# Altium schematic sheet 0050_X16 PEG P0-P7 COUP.SchDoc
size A3
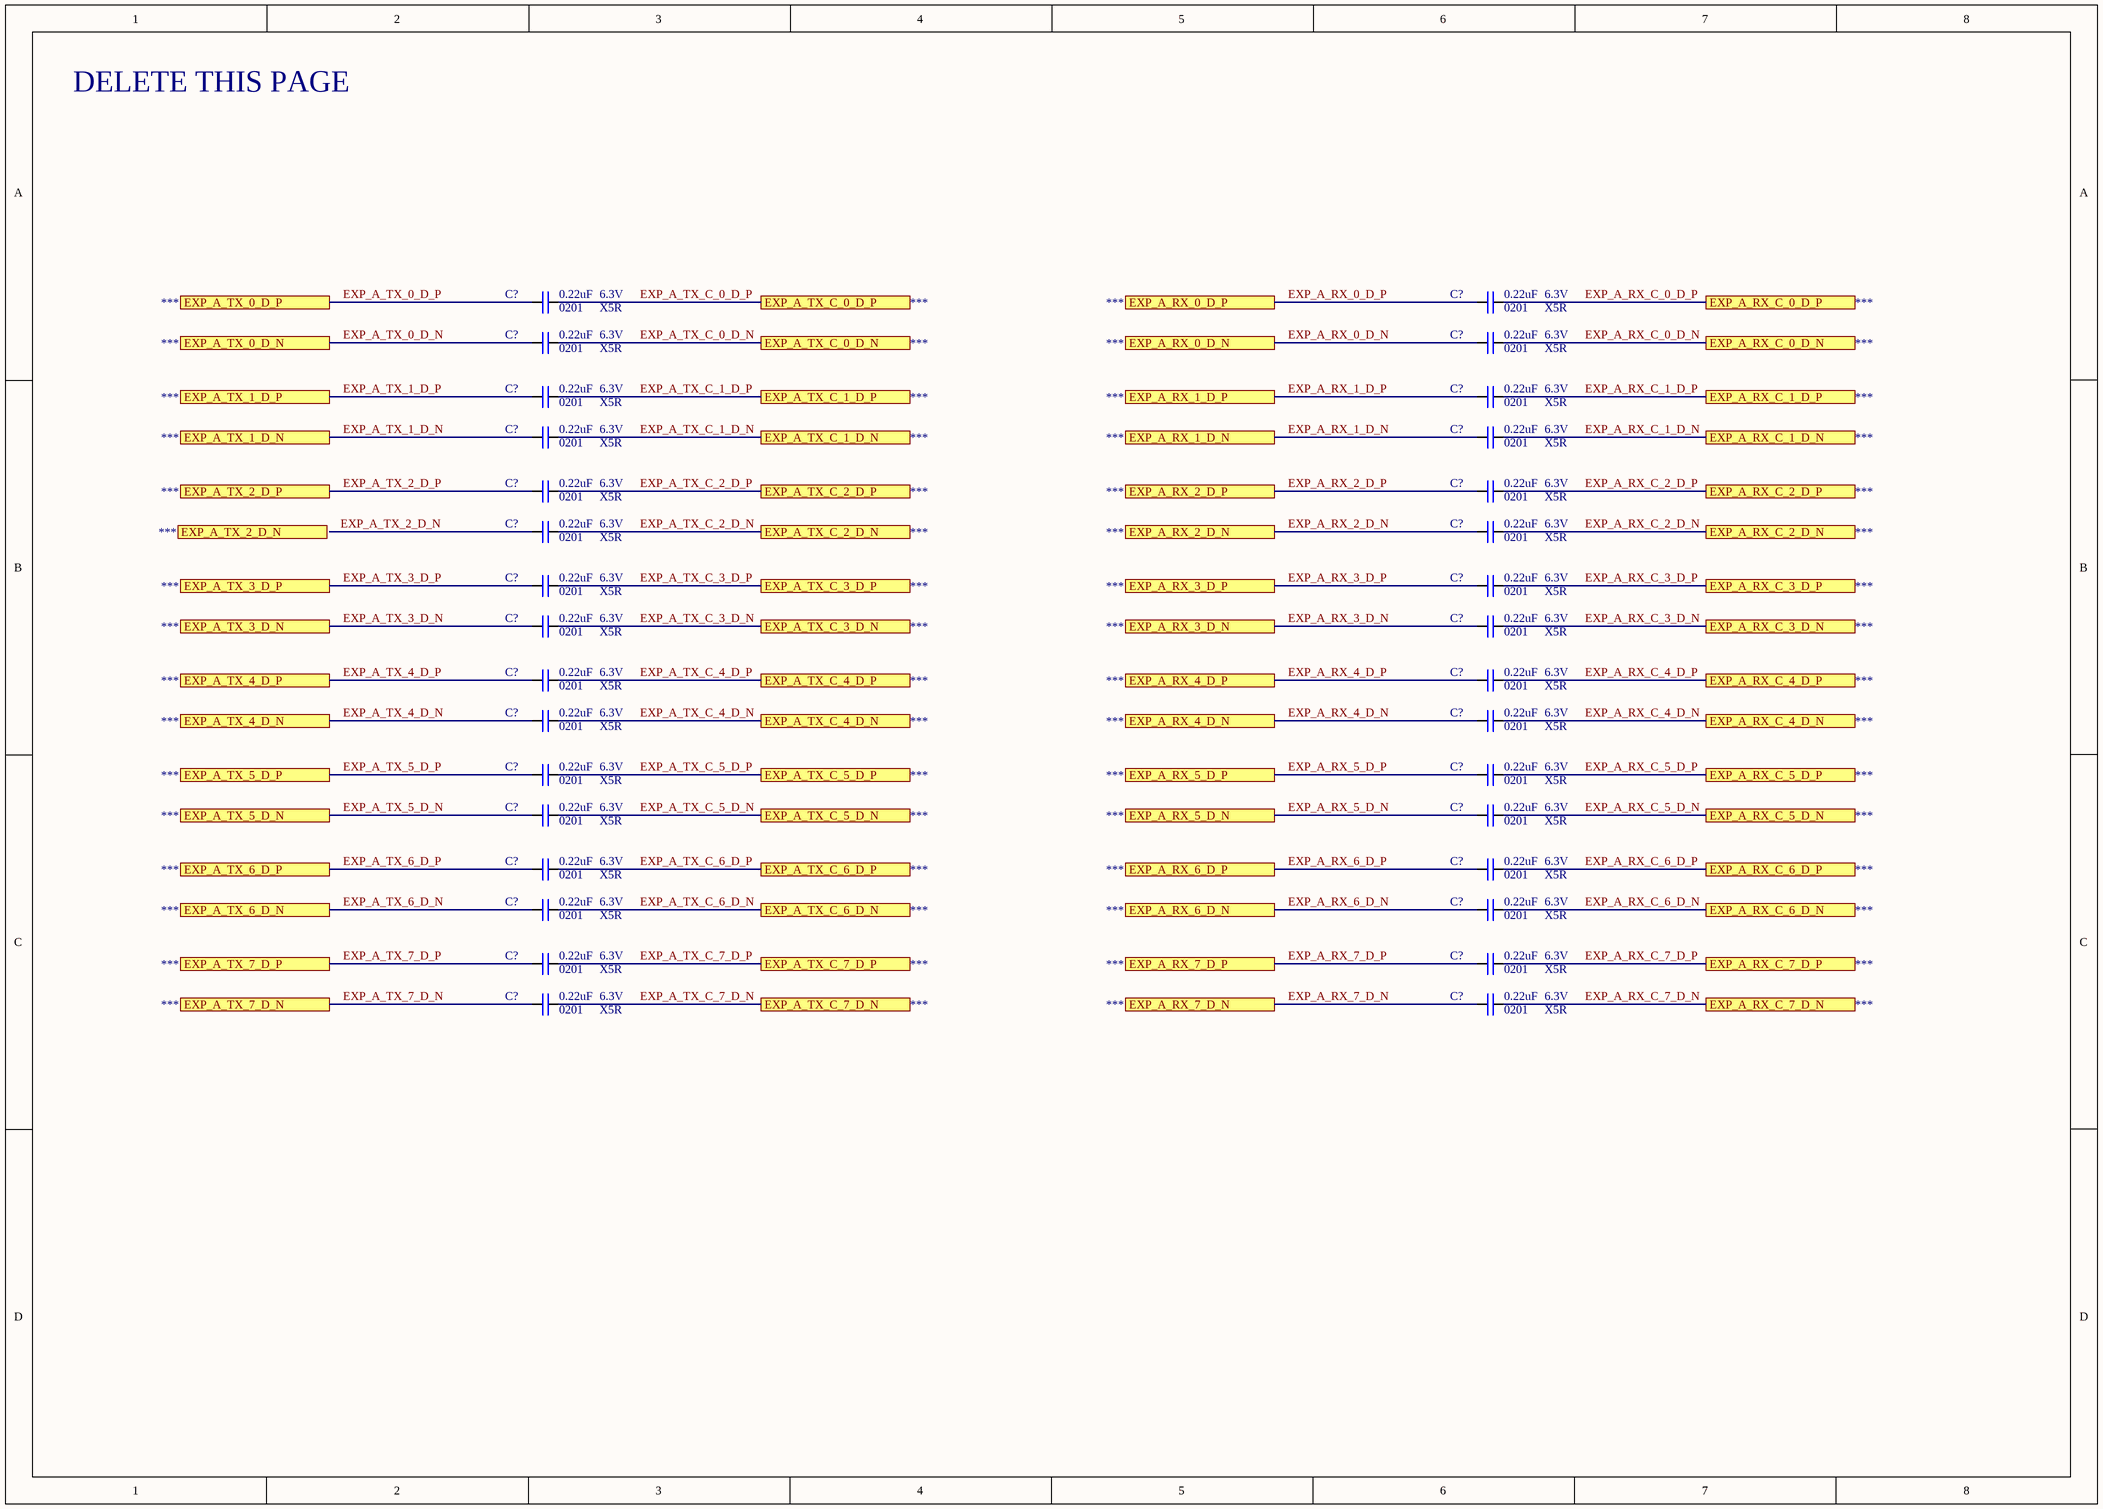
[diagram p0: 0050_X16 PEG P0-P7 COUP.SchDoc]

## Parts
(Parts that share a designator on the sheet are numbered #1, #2 ... from top to bottom, then left to right.)
C?#1  value 0.22uF  Case/Package: 0201  Voltage: 6.3V  Dielectric: X5R  [CAPC0201]
C?#2  value 0.22uF  Case/Package: 0201  Voltage: 6.3V  Dielectric: X5R  [CAPC0201]
C?#3  value 0.22uF  Case/Package: 0201  Voltage: 6.3V  Dielectric: X5R  [CAPC0201]
C?#4  value 0.22uF  Case/Package: 0201  Voltage: 6.3V  Dielectric: X5R  [CAPC0201]
C?#5  value 0.22uF  Case/Package: 0201  Voltage: 6.3V  Dielectric: X5R  [CAPC0201]
C?#6  value 0.22uF  Case/Package: 0201  Voltage: 6.3V  Dielectric: X5R  [CAPC0201]
C?#7  value 0.22uF  Case/Package: 0201  Voltage: 6.3V  Dielectric: X5R  [CAPC0201]
C?#8  value 0.22uF  Case/Package: 0201  Voltage: 6.3V  Dielectric: X5R  [CAPC0201]
C?#9  value 0.22uF  Case/Package: 0201  Voltage: 6.3V  Dielectric: X5R  [CAPC0201]
C?#10  value 0.22uF  Case/Package: 0201  Voltage: 6.3V  Dielectric: X5R  [CAPC0201]
C?#11  value 0.22uF  Case/Package: 0201  Voltage: 6.3V  Dielectric: X5R  [CAPC0201]
C?#12  value 0.22uF  Case/Package: 0201  Voltage: 6.3V  Dielectric: X5R  [CAPC0201]
C?#13  value 0.22uF  Case/Package: 0201  Voltage: 6.3V  Dielectric: X5R  [CAPC0201]
C?#14  value 0.22uF  Case/Package: 0201  Voltage: 6.3V  Dielectric: X5R  [CAPC0201]
C?#15  value 0.22uF  Case/Package: 0201  Voltage: 6.3V  Dielectric: X5R  [CAPC0201]
C?#16  value 0.22uF  Case/Package: 0201  Voltage: 6.3V  Dielectric: X5R  [CAPC0201]
C?#17  value 0.22uF  Case/Package: 0201  Voltage: 6.3V  Dielectric: X5R  [CAPC0201]
C?#18  value 0.22uF  Case/Package: 0201  Voltage: 6.3V  Dielectric: X5R  [CAPC0201]
C?#19  value 0.22uF  Case/Package: 0201  Voltage: 6.3V  Dielectric: X5R  [CAPC0201]
C?#20  value 0.22uF  Case/Package: 0201  Voltage: 6.3V  Dielectric: X5R  [CAPC0201]
C?#21  value 0.22uF  Case/Package: 0201  Voltage: 6.3V  Dielectric: X5R  [CAPC0201]
C?#22  value 0.22uF  Case/Package: 0201  Voltage: 6.3V  Dielectric: X5R  [CAPC0201]
C?#23  value 0.22uF  Case/Package: 0201  Voltage: 6.3V  Dielectric: X5R  [CAPC0201]
C?#24  value 0.22uF  Case/Package: 0201  Voltage: 6.3V  Dielectric: X5R  [CAPC0201]
C?#25  value 0.22uF  Case/Package: 0201  Voltage: 6.3V  Dielectric: X5R  [CAPC0201]
C?#26  value 0.22uF  Case/Package: 0201  Voltage: 6.3V  Dielectric: X5R  [CAPC0201]
C?#27  value 0.22uF  Case/Package: 0201  Voltage: 6.3V  Dielectric: X5R  [CAPC0201]
C?#28  value 0.22uF  Case/Package: 0201  Voltage: 6.3V  Dielectric: X5R  [CAPC0201]
C?#29  value 0.22uF  Case/Package: 0201  Voltage: 6.3V  Dielectric: X5R  [CAPC0201]
C?#30  value 0.22uF  Case/Package: 0201  Voltage: 6.3V  Dielectric: X5R  [CAPC0201]
C?#31  value 0.22uF  Case/Package: 0201  Voltage: 6.3V  Dielectric: X5R  [CAPC0201]
C?#32  value 0.22uF  Case/Package: 0201  Voltage: 6.3V  Dielectric: X5R  [CAPC0201]

## Ports
EXP_A_RX_0_D_N, EXP_A_RX_0_D_P, EXP_A_RX_1_D_N, EXP_A_RX_1_D_P, EXP_A_RX_2_D_N, EXP_A_RX_2_D_P, EXP_A_RX_3_D_N, EXP_A_RX_3_D_P, EXP_A_RX_4_D_N, EXP_A_RX_4_D_P, EXP_A_RX_5_D_N, EXP_A_RX_5_D_P, EXP_A_RX_6_D_N, EXP_A_RX_6_D_P, EXP_A_RX_7_D_N, EXP_A_RX_7_D_P, EXP_A_RX_C_0_D_N, EXP_A_RX_C_0_D_P, EXP_A_RX_C_1_D_N, EXP_A_RX_C_1_D_P, EXP_A_RX_C_2_D_N, EXP_A_RX_C_2_D_P, EXP_A_RX_C_3_D_N, EXP_A_RX_C_3_D_P, EXP_A_RX_C_4_D_N, EXP_A_RX_C_4_D_P, EXP_A_RX_C_5_D_N, EXP_A_RX_C_5_D_P, EXP_A_RX_C_6_D_N, EXP_A_RX_C_6_D_P, EXP_A_RX_C_7_D_N, EXP_A_RX_C_7_D_P, EXP_A_TX_0_D_N, EXP_A_TX_0_D_P, EXP_A_TX_1_D_N, EXP_A_TX_1_D_P, EXP_A_TX_2_D_N, EXP_A_TX_2_D_P, EXP_A_TX_3_D_N, EXP_A_TX_3_D_P, EXP_A_TX_4_D_N, EXP_A_TX_4_D_P, EXP_A_TX_5_D_N, EXP_A_TX_5_D_P, EXP_A_TX_6_D_N, EXP_A_TX_6_D_P, EXP_A_TX_7_D_N, EXP_A_TX_7_D_P, EXP_A_TX_C_0_D_N, EXP_A_TX_C_0_D_P, EXP_A_TX_C_1_D_N, EXP_A_TX_C_1_D_P, EXP_A_TX_C_2_D_N, EXP_A_TX_C_2_D_P, EXP_A_TX_C_3_D_N, EXP_A_TX_C_3_D_P, EXP_A_TX_C_4_D_N, EXP_A_TX_C_4_D_P, EXP_A_TX_C_5_D_N, EXP_A_TX_C_5_D_P, EXP_A_TX_C_6_D_N, EXP_A_TX_C_6_D_P, EXP_A_TX_C_7_D_N, EXP_A_TX_C_7_D_P

## Nets
EXP_A_RX_0_D_N: C?#4.1 ; port EXP_A_RX_0_D_N
EXP_A_RX_0_D_P: C?#2.1 ; port EXP_A_RX_0_D_P
EXP_A_RX_1_D_N: C?#8.1 ; port EXP_A_RX_1_D_N
EXP_A_RX_1_D_P: C?#6.1 ; port EXP_A_RX_1_D_P
EXP_A_RX_2_D_N: C?#12.1 ; port EXP_A_RX_2_D_N
EXP_A_RX_2_D_P: C?#10.1 ; port EXP_A_RX_2_D_P
EXP_A_RX_3_D_N: C?#16.1 ; port EXP_A_RX_3_D_N
EXP_A_RX_3_D_P: C?#14.1 ; port EXP_A_RX_3_D_P
EXP_A_RX_4_D_N: C?#20.1 ; port EXP_A_RX_4_D_N
EXP_A_RX_4_D_P: C?#18.1 ; port EXP_A_RX_4_D_P
EXP_A_RX_5_D_N: C?#24.1 ; port EXP_A_RX_5_D_N
EXP_A_RX_5_D_P: C?#22.1 ; port EXP_A_RX_5_D_P
EXP_A_RX_6_D_N: C?#28.1 ; port EXP_A_RX_6_D_N
EXP_A_RX_6_D_P: C?#26.1 ; port EXP_A_RX_6_D_P
EXP_A_RX_7_D_N: C?#32.1 ; port EXP_A_RX_7_D_N
EXP_A_RX_7_D_P: C?#30.1 ; port EXP_A_RX_7_D_P
EXP_A_RX_C_0_D_N: C?#4.2 ; port EXP_A_RX_C_0_D_N
EXP_A_RX_C_0_D_P: C?#2.2 ; port EXP_A_RX_C_0_D_P
EXP_A_RX_C_1_D_N: C?#8.2 ; port EXP_A_RX_C_1_D_N
EXP_A_RX_C_1_D_P: C?#6.2 ; port EXP_A_RX_C_1_D_P
EXP_A_RX_C_2_D_N: C?#12.2 ; port EXP_A_RX_C_2_D_N
EXP_A_RX_C_2_D_P: C?#10.2 ; port EXP_A_RX_C_2_D_P
EXP_A_RX_C_3_D_N: C?#16.2 ; port EXP_A_RX_C_3_D_N
EXP_A_RX_C_3_D_P: C?#14.2 ; port EXP_A_RX_C_3_D_P
EXP_A_RX_C_4_D_N: C?#20.2 ; port EXP_A_RX_C_4_D_N
EXP_A_RX_C_4_D_P: C?#18.2 ; port EXP_A_RX_C_4_D_P
EXP_A_RX_C_5_D_N: C?#24.2 ; port EXP_A_RX_C_5_D_N
EXP_A_RX_C_5_D_P: C?#22.2 ; port EXP_A_RX_C_5_D_P
EXP_A_RX_C_6_D_N: C?#28.2 ; port EXP_A_RX_C_6_D_N
EXP_A_RX_C_6_D_P: C?#26.2 ; port EXP_A_RX_C_6_D_P
EXP_A_RX_C_7_D_N: C?#32.2 ; port EXP_A_RX_C_7_D_N
EXP_A_RX_C_7_D_P: C?#30.2 ; port EXP_A_RX_C_7_D_P
EXP_A_TX_0_D_N: C?#3.1 ; port EXP_A_TX_0_D_N
EXP_A_TX_0_D_P: C?#1.1 ; port EXP_A_TX_0_D_P
EXP_A_TX_1_D_N: C?#7.1 ; port EXP_A_TX_1_D_N
EXP_A_TX_1_D_P: C?#5.1 ; port EXP_A_TX_1_D_P
EXP_A_TX_2_D_N: C?#11.1
EXP_A_TX_2_D_P: C?#9.1 ; port EXP_A_TX_2_D_P
EXP_A_TX_3_D_N: C?#15.1 ; port EXP_A_TX_3_D_N
EXP_A_TX_3_D_P: C?#13.1 ; port EXP_A_TX_3_D_P
EXP_A_TX_4_D_N: C?#19.1 ; port EXP_A_TX_4_D_N
EXP_A_TX_4_D_P: C?#17.1 ; port EXP_A_TX_4_D_P
EXP_A_TX_5_D_N: C?#23.1 ; port EXP_A_TX_5_D_N
EXP_A_TX_5_D_P: C?#21.1 ; port EXP_A_TX_5_D_P
EXP_A_TX_6_D_N: C?#27.1 ; port EXP_A_TX_6_D_N
EXP_A_TX_6_D_P: C?#25.1 ; port EXP_A_TX_6_D_P
EXP_A_TX_7_D_N: C?#31.1 ; port EXP_A_TX_7_D_N
EXP_A_TX_7_D_P: C?#29.1 ; port EXP_A_TX_7_D_P
EXP_A_TX_C_0_D_N: C?#3.2 ; port EXP_A_TX_C_0_D_N
EXP_A_TX_C_0_D_P: C?#1.2 ; port EXP_A_TX_C_0_D_P
EXP_A_TX_C_1_D_N: C?#7.2 ; port EXP_A_TX_C_1_D_N
EXP_A_TX_C_1_D_P: C?#5.2 ; port EXP_A_TX_C_1_D_P
EXP_A_TX_C_2_D_N: C?#11.2 ; port EXP_A_TX_C_2_D_N
EXP_A_TX_C_2_D_P: C?#9.2 ; port EXP_A_TX_C_2_D_P
EXP_A_TX_C_3_D_N: C?#15.2 ; port EXP_A_TX_C_3_D_N
EXP_A_TX_C_3_D_P: C?#13.2 ; port EXP_A_TX_C_3_D_P
EXP_A_TX_C_4_D_N: C?#19.2 ; port EXP_A_TX_C_4_D_N
EXP_A_TX_C_4_D_P: C?#17.2 ; port EXP_A_TX_C_4_D_P
EXP_A_TX_C_5_D_N: C?#23.2 ; port EXP_A_TX_C_5_D_N
EXP_A_TX_C_5_D_P: C?#21.2 ; port EXP_A_TX_C_5_D_P
EXP_A_TX_C_6_D_N: C?#27.2 ; port EXP_A_TX_C_6_D_N
EXP_A_TX_C_6_D_P: C?#25.2 ; port EXP_A_TX_C_6_D_P
EXP_A_TX_C_7_D_N: C?#31.2 ; port EXP_A_TX_C_7_D_N
EXP_A_TX_C_7_D_P: C?#29.2 ; port EXP_A_TX_C_7_D_P

## Notes on the sheet
- DELETE THIS PAGE

## Library data of the parts
C?#1-C?#32 = Cap: CAP CER 10pF 6.3V X5R 0201